# Altium schematic sheet GyroSense.SchDoc
size A
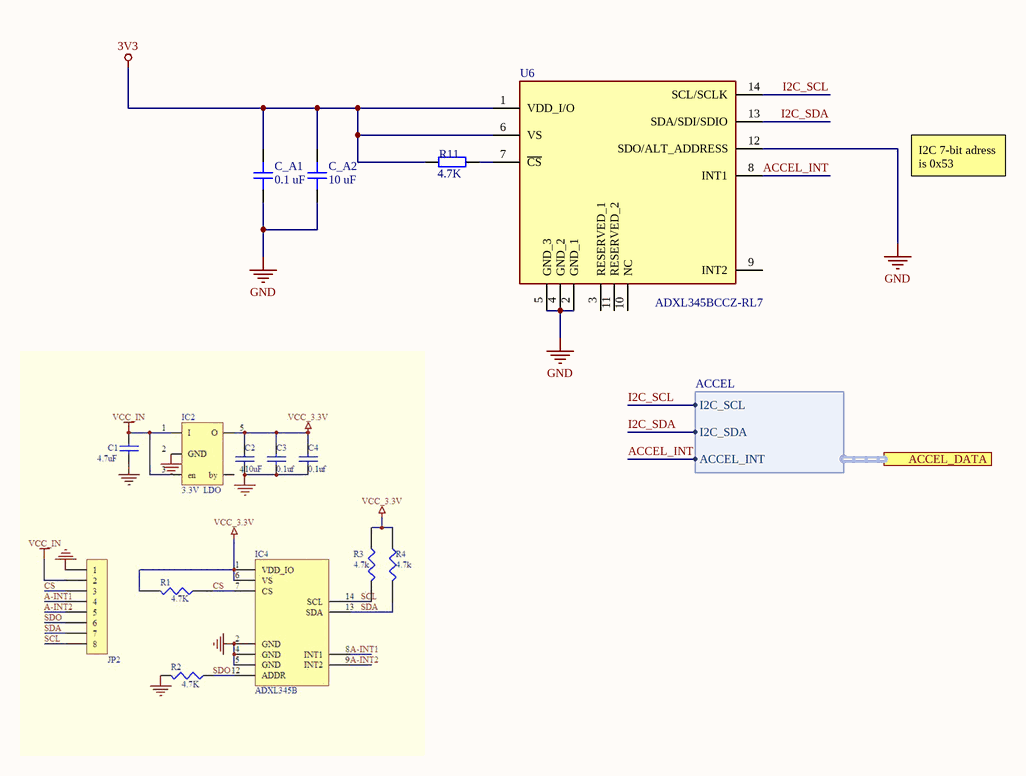
[diagram p0: GyroSense.SchDoc]

## Parts
C_A1  0.1 uF  [CAP_0603]
C_A2  10 uF  [CAP_0603]
R11  4.7K  [RES_0603]
U6  ADXL345BCCZ-RL7  [ADXL345BCCZRL7]

## Ports
ACCEL_DATA (harness ACCEL)

## Harnesses
ACCEL: I2C_SCL, ACCEL_INT, I2C_SDA

## Nets
3V3: C_A1.2 C_A2.2 R11.1 U6.1(VDD_I/O) U6.6(VS)
GND: C_A1.1 C_A2.1 U6.2(GND_1) U6.4(GND_2) U6.5(GND_3) U6.12(SDO/ALT_ADDRESS)
ACCEL_INT: U6.8(INT1) ; port ACCEL_DATA.ACCEL_INT
I2C_SCL: U6.14(SCL/SCLK) ; port ACCEL_DATA.I2C_SCL
I2C_SDA: U6.13(SDA/SDI/SDIO) ; port ACCEL_DATA.I2C_SDA
NetR11_2: R11.2 U6.7(~{CS})

Not connected (* = marked no-connect by the designer): U6 3(RESERVED_1) 9(INT2) 10(NC) 11(RESERVED_2)

## Notes on the sheet
- I2C 7-bit adress is 0x53

## Library data of the parts
C_A1 C_A2 = CAP_0603: Capacitor SMD 0603; Manufacturer: *; Manufacturer Part Number: *; Distributor Link: *; LCSC: *; Rating: *; Dielectric: *
R11 = RES_0603: Resistor SMD 0603; Manufacturer: *; Manufacturer Part Number: *; Distributor Link: *; LCSC: *
U6 = ADXL345BCCZ-RL7: ADXL345BCCZ-RL7 Analog Devices, 3-Axis Accelerometer, I2C, SPI, 14-Pin LGA 0.3 V to +3.9 V 40C to +105C; Geometry.Height: 1mm; Manufacturer_Name: Analog Devices; Manufacturer_Part_Number: ADXL345BCCZ-RL7; Mouser Part Number: 584-ADXL345BCCZ-R7; Mouser Price/Stock: https://www.mouser.co.uk/ProductDetail/Analog-Devices/ADXL345BCCZ-RL7?qs=WIvQP4zGaninp9Gc%252BCsJzQ%3D%3D; Arrow Part Number: ADXL345BCCZ-RL7; Arrow Price/Stock: https://www.arrow.com/en/products/adxl345bccz-rl7/analog-devices?utm_currency=USD&region=nac; Datasheet Link: https://www.analog.com/media/en/technical-documentation/data-sheets/adxl345.pdf